# Altium project 机械臂扩展板2.0.PrjPcb
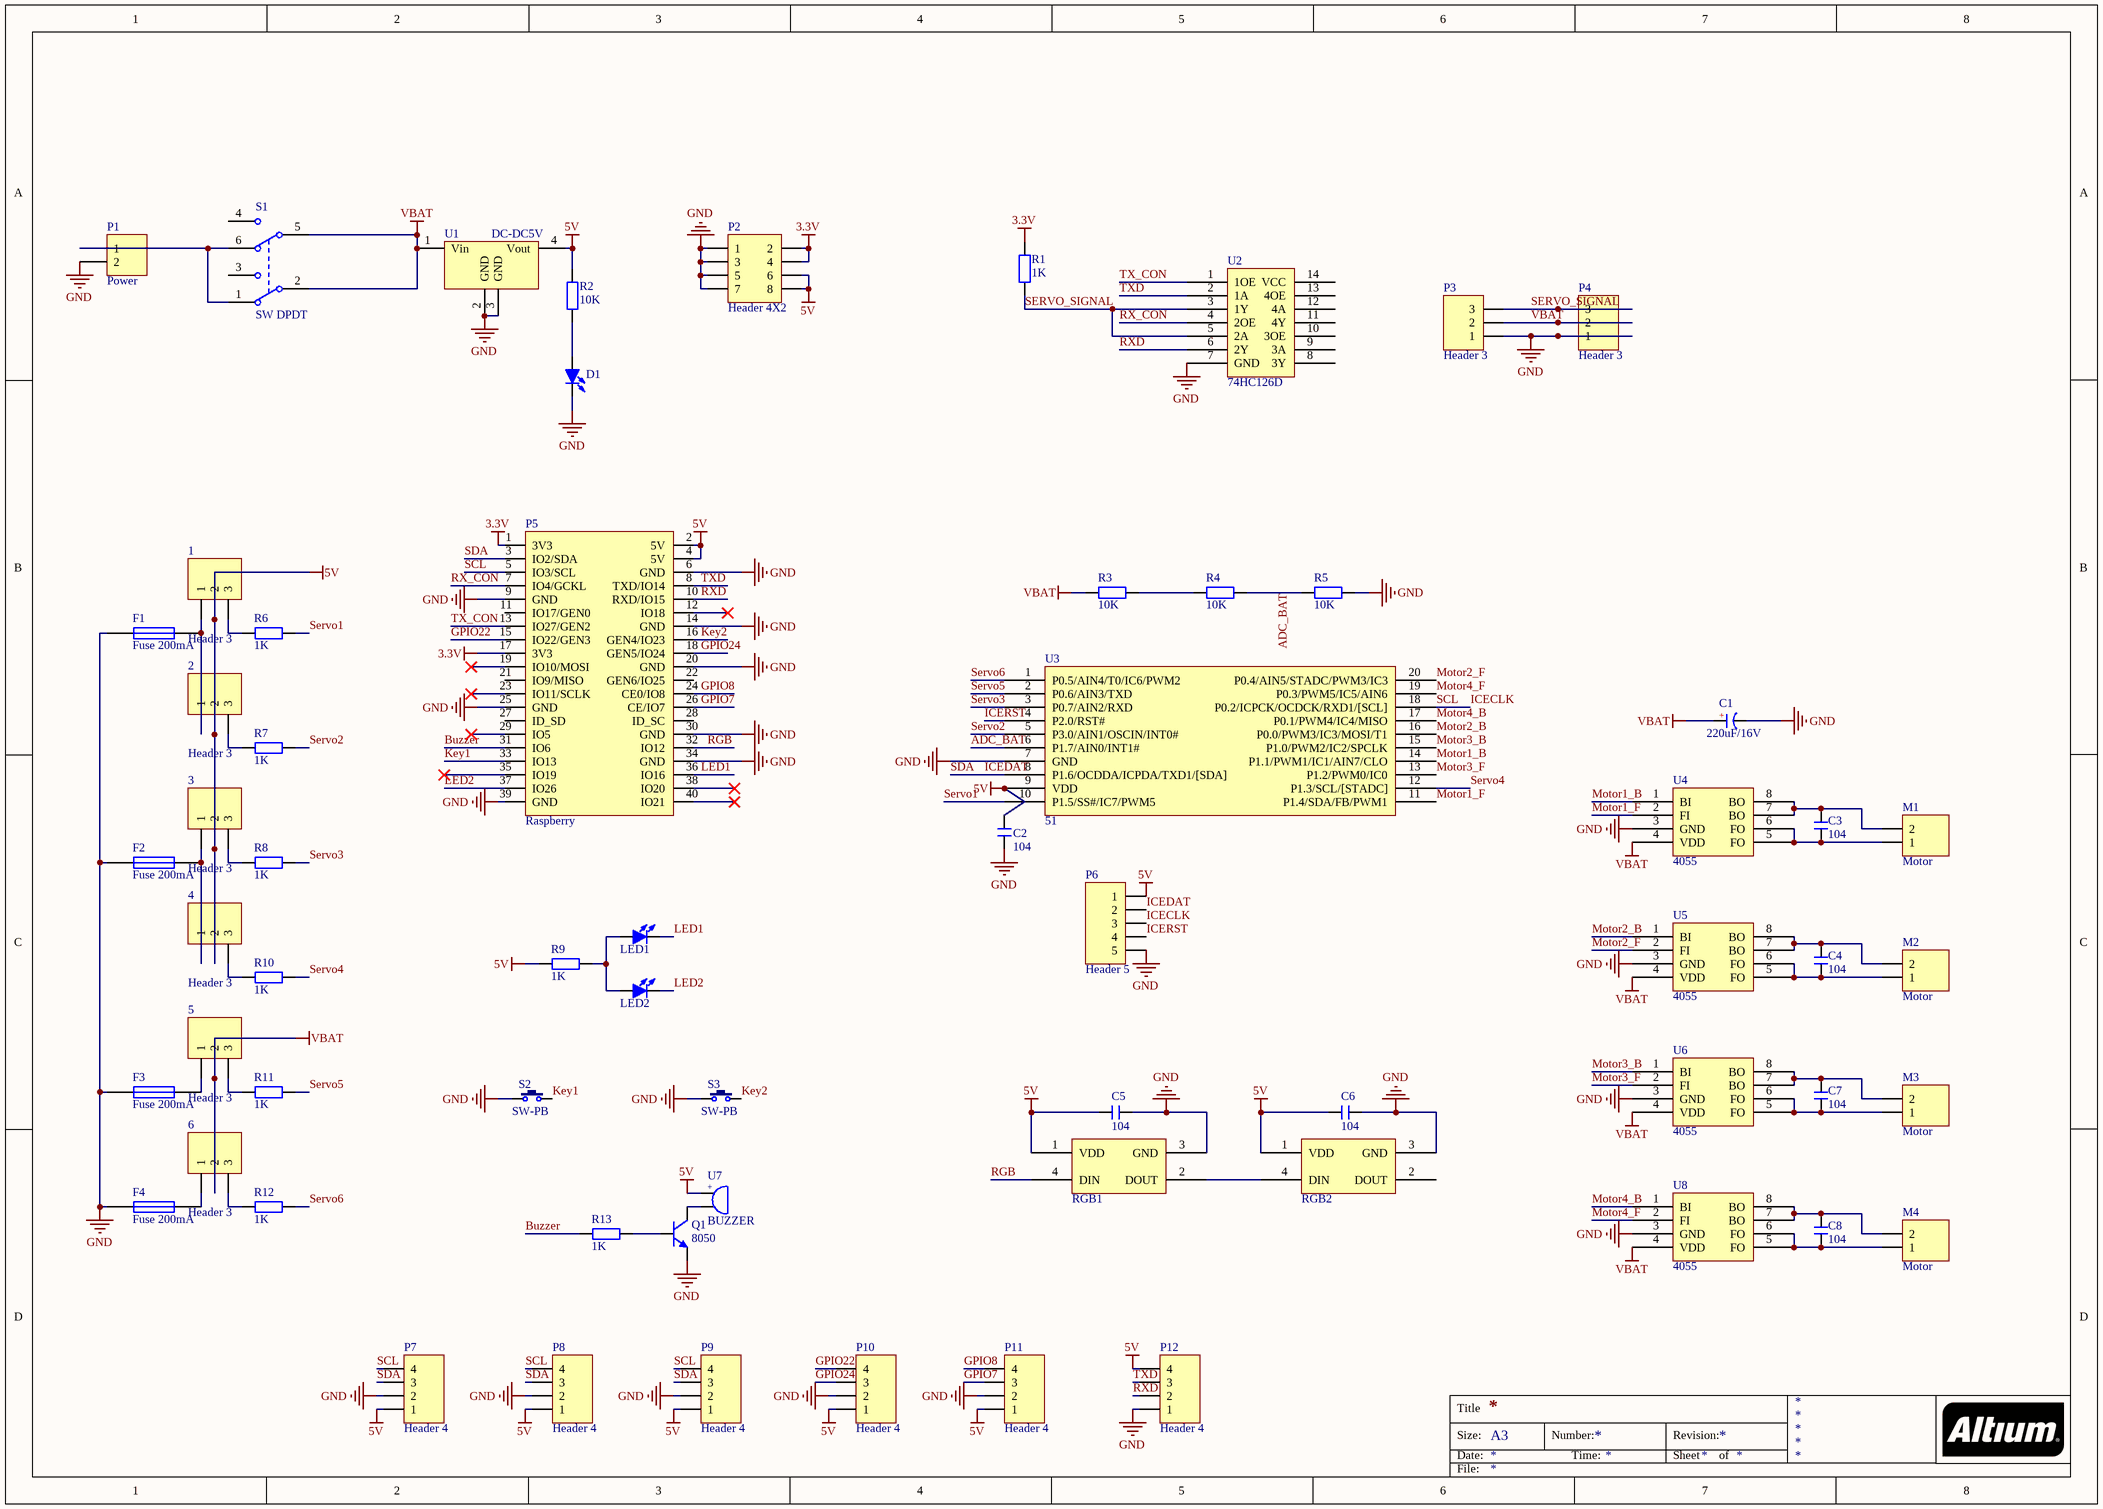
[diagram p0: 机械臂扩展板2.0.SchDoc]
1 sheet, 64 parts. Net scope: global (net labels, ports and power ports of the same name join across sheets).
Board file: 机械臂扩展板2.0.PcbDoc

## Sheet 机械臂扩展板2.0.SchDoc
size A3

### Parts
1  Header 3  [HDR2.54-LI-3P]
2  Header 3  [HDR2.54-LI-3P]
3  Header 3  [HDR2.54-LI-3P]
4  Header 3  [HDR2.54-LI-3P]
5  Header 3  [HDR2.54-LI-3P]
6  Header 3  [HDR2.54-LI-3P]
C1  220uF/16V  [CM D(6.3*7.7)]
C2  104  [C 0603_L]
C3  104  [C 0603_L]
C4  104  [C 0603_L]
C5  104  [C 0603_L]
C6  104  [C 0603_L]
C7  104  [C 0603_L]
C8  104  [C 0603_L]
D1  红色  [LED 0603R]  (value not drawn)
F1  Fuse 200mA  [F1206]
F2  Fuse 200mA  [F1206]
F3  Fuse 200mA  [F1206]
F4  Fuse 200mA  [F1206]
LED1  红色  [LED 0603G]  (value not drawn)
LED2  红色  [LED 0603G]  (value not drawn)
M1  Motor  [XH2.54-LI-2P]
M2  Motor  [XH2.54-LI-2P]
M3  Motor  [XH2.54-LI-2P]
M4  Motor  [XH2.54-LI-2P]
P1  Power  [KF128-3.81-2P]
P2  Header 4X2  [HDR2.54-LI-2x4P]
P3  Header 3  [XH2.54-LI-3P]
P4  Header 3  [XH2.54-LI-3P]
P6  Header 5  [HDR2.54-LI-5P]
P7  Header 4  [XH2.54-WI-4P]
P8  Header 4  [XH2.54-WI-4P]
P9  Header 4  [XH2.54-WI-4P]
P10  Header 4  [XH2.54-LI-4P]
P11  Header 4  [XH2.54-LI-4P]
P12  Header 4  [HDR2.54-LI-4P]
Q1  8050  [SOT23-3L]
R1  1K  [R 0603_L]
R2  10K  [R 0603_L]
R3  10K  [R 0603_L]
R4  10K  [R 0603_L]
R5  10K  [R 0603_L]
R6  1K  [R 0603_L]
R7  1K  [R 0603_L]
R8  1K  [R 0603_L]
R9  1K  [R 0603_L]
R10  1K  [R 0603_L]
R11  1K  [R 0603_L]
R12  1K  [R 0603_L]
R13  1K  [R 0603_L]
Raspberry  P5  [HDR2.54-LI-2x20P]
RGB1  (no value)  [LED 3528-4Pin]
RGB2  (no value)  [LED 3528-4Pin]
S1  SW DPDT  [SK-22D02]
S2  SW-PB  [TSW SMD-3*6*4.3]
S3  SW-PB  [TSW SMD-3*6*4.3]
U1  DC-DC5V  [升压模块]
U2  74HC126D  [SOP14_L]
U3  51  [TSSOP20_L]
U4  4055  [SOP8_L]
U5  4055  [SOP8_L]
U6  4055  [SOP8_L]
U7  BUZZER  [BEEP 5x9x5.5]
U8  4055  [SOP8_L]

### Nets
3.3V: P2.2 P2.4 R1.2 Raspberry.1(3V3) Raspberry.17(3V3)
5V: 1.2 2.2 3.2 4.2 C2.2 C5.1 C6.1 P2.6 P2.8 P6.1 P7.1 P8.1 P9.1 P10.1 P11.1 P12.4 R2.2 R9.1 Raspberry.2(5V) Raspberry.4(5V) RGB1.1(VDD) RGB2.1(VDD) U1.4(Vout) U3.9(VDD) U7.1
GND: C1.2(K) C2.1 C5.2 C6.2 D1.2(K) F1.1 F2.1 F3.1 F4.1 P1.2 P2.1 P2.3 P2.5 P2.7 P3.1 P4.1 P6.5 P7.2 P8.2 P9.2 P10.2 P11.2 P12.1 Q1.2(E) R5.2 Raspberry.6(GND) Raspberry.9(GND) Raspberry.14(GND) Raspberry.20(GND) Raspberry.25(GND) Raspberry.30(GND) Raspberry.34(GND) Raspberry.39(GND) RGB1.3(GND) RGB2.3(GND) S2.1 S3.1 U1.2(GND) U1.3(GND) U2.7(GND) U3.7(GND) U4.3(GND) U5.3(GND) U6.3(GND) U8.3(GND)
VBAT: 5.2 6.2 C1.1(A) P3.2 P4.2 R3.1 S1.2 S1.5 U1.1(Vin) U4.4(VDD) U5.4(VDD) U6.4(VDD) U8.4(VDD)
ADC_BAT: R4.2 R5.1 U3.6(P1.7/AIN0/INT1#)
Buzzer: R13.1 Raspberry.31(IO6)
GPIO7: P11.3 Raspberry.26(CE/IO7)
GPIO8: P11.4 Raspberry.24(CE0/IO8)
GPIO22: P10.4 Raspberry.15(IO22/GEN3)
GPIO24: P10.3 Raspberry.18(GEN5/IO24)
ICECLK: P6.3 P7.4 P8.4 P9.4 Raspberry.5(IO3/SCL) U3.18(P0.2/ICPCK/OCDCK/RXD1/[SCL])  [also labelled SCL]
ICEDAT: P6.2 P7.3 P8.3 P9.3 Raspberry.3(IO2/SDA) U3.8(P1.6/OCDDA/ICPDA/TXD1/[SDA])  [also labelled SDA]
ICERST: P6.4 U3.4(P2.0/RST#)
Key1: Raspberry.33(IO13) S2.2
Key2: Raspberry.16(GEN4/IO23) S3.2
LED1: LED1.2(K) Raspberry.36(IO16)
LED2: LED2.2(K) Raspberry.37(IO26)
Motor1_B: U3.14(P1.1/PWM1/IC1/AIN7/CLO) U4.1(BI)
Motor1_F: U3.11(P1.4/SDA/FB/PWM1) U4.2(FI)
Motor2_B: U3.16(P0.0/PWM3/IC3/MOSI/T1) U5.1(BI)
Motor2_F: U3.20(P0.4/AIN5/STADC/PWM3/IC3) U5.2(FI)
Motor3_B: U3.15(P1.0/PWM2/IC2/SPCLK) U6.1(BI)
Motor3_F: U3.13(P1.2/PWM0/IC0) U6.2(FI)
Motor4_B: U3.17(P0.1/PWM4/IC4/MISO) U8.1(BI)
Motor4_F: U3.19(P0.3/PWM5/IC5/AIN6) U8.2(FI)
RGB: Raspberry.32(IO12) RGB1.4(DIN)
RX_CON: Raspberry.7(IO4/GCKL) U2.4(2OE)
RXD: P12.2 Raspberry.10(RXD/IO15) U2.6(2Y)
Servo1: R6.2 U3.10(P1.5/SS#/IC7/PWM5)
Servo2: R7.2 U3.5(P3.0/AIN1/OSCIN/INT0#)
Servo3: R8.2 U3.3(P0.7/AIN2/RXD)
Servo4: R10.2 U3.12(P1.3/SCL/[STADC])
Servo5: R11.2 U3.2(P0.6/AIN3/TXD)
Servo6: R12.2 U3.1(P0.5/AIN4/T0/IC6/PWM2)
SERVO_SIGNAL: P3.3 P4.3 R1.1 U2.3(1Y) U2.5(2A)
TX_CON: Raspberry.13(IO27/GEN2) U2.1(1OE)
TXD: P12.3 Raspberry.8(TXD/IO14) U2.2(1A)
Net1_1: 1.1 2.1 F1.2
Net1_3: 1.3 R6.1
Net2_3: 2.3 R7.1
Net3_1: 3.1 4.1 F2.2
Net3_3: 3.3 R8.1
Net4_3: 4.3 R10.1
Net5_1: 5.1 F3.2
Net5_3: 5.3 R11.1
Net6_1: 6.1 F4.2
Net6_3: 6.3 R12.1
NetC3_1: C3.1 M1.1 U4.5(FO) U4.6(FO)
NetC3_2: C3.2 M1.2 U4.7(BO) U4.8(BO)
NetC4_1: C4.1 M2.1 U5.5(FO) U5.6(FO)
NetC4_2: C4.2 M2.2 U5.7(BO) U5.8(BO)
NetC7_1: C7.1 M3.1 U6.5(FO) U6.6(FO)
NetC7_2: C7.2 M3.2 U6.7(BO) U6.8(BO)
NetC8_1: C8.1 M4.1 U8.5(FO) U8.6(FO)
NetC8_2: C8.2 M4.2 U8.7(BO) U8.8(BO)
NetD1_1: D1.1(A) R2.1
NetLED1_1: LED1.1(A) LED2.1(A) R9.2
NetP1_1: P1.1 S1.1 S1.6
NetQ1_1: Q1.1(B) R13.2
NetQ1_3: Q1.3(C) U7.2
NetR3_2: R3.2 R4.1
NetRGB1_2: RGB1.2(DOUT) RGB2.4(DIN)

Not connected (* = marked no-connect by the designer): Raspberry 11(IO17/GEN0) 12(IO18)* 19(IO10/MOSI)* 21(IO9/MISO) 22(GEN6/IO25) 23(IO11/SCLK)* 27(ID_SD) 28(ID_SC) 29(IO5)* 35(IO19)* 38(IO20)* 40(IO21)*; RGB2 2(DOUT); S1 3 4; U2 8(3Y) 9(3A) 10(3OE) 11(4Y) 12(4A) 13(4OE) 14(VCC)

### Notes on the sheet
- Title
- Size:
- Date:
- A3
- Number:
- Time:
- Revision:
- Sheet
- of
- File:
- (in symbol BEEP) +
- (in symbol C-CM) +

### Library data of the parts
1-6 P3 P4 = Header 3: 舵机接口; BOM名称: 3P接插件; 版权归属: 源创客; 学习资源: www.ooocke.com
C1 = C-CM: 贴片电解电容; 版权归属: 源创客; BOM名称: 贴片电解电容; 学习资源: www.ooocke.com
C2-C8 = C: 无极性贴片电容; 版权归属: 源创客; BOM名称: 无极性贴片电容; 学习资源: www.ooocke.com
D1 LED1 LED2 = LED-SMD: 贴片LED; 版权归属: 源创客; BOM名称: 贴片LED; 学习资源: www.ooocke.com
F1-F4 = Fuse 1: Fuse; Published: 8-Jun-2000; LatestRevisionDate: 17-Jul-2002; LatestRevisionNote: Re-released for DXP Platform.; PackageReference: PIN-W2/E2.8; Publisher: Altium Limited; PackageDescription: Thru-Hole; 2 Leads
M1-M4 = Header 2: 2P接插件; 版权归属: 源创客; BOM名称: 2P接插件; 学习资源: www.ooocke.com
P2 = Header 4X2: 4*2P接插件; 版权归属: 源创客; BOM名称: 4*2P接插件; 学习资源: www.ooocke.com
P6 = Header 5: 5P接插件; 版权归属: 源创客; BOM名称: 5P接插件; 学习资源: www.ooocke.com
P7-P12 = Header 4: I2C总线接口; BOM名称: 4P接插件; 版权归属: 源创客; 学习资源: www.ooocke.com
Q1 = 8050-SMD: 高频放大-NPN型; 版权归属: 源创客; 属性: 40V 1.5A 1W 100MHZ; BOM名称: 高频放大-NPN型; 学习资源: www.ooocke.com
R1-R13 = R: 贴片电阻; 版权归属: 源创客; BOM名称: 贴片电阻; 学习资源: www.ooocke.com
Raspberry = Header 20X2: 树莓派接口; BOM名称: 20*2P接插件; 版权归属: 源创客; 学习资源: www.ooocke.com
RGB1 RGB2 = RGBLED
S1 = SSW-2P: 2路波动开关; BOM名称: 波动开关; 版权归属: 源创客; 学习资源: www.ooocke.com
S2 S3 = TSW 3x6: 3x6轻触开关; 版权归属: 源创客; BOM名称: 3x6轻触开关; 学习资源: www.ooocke.com
U7 = BEEP: 蜂鸣器; 版权归属: 源创客; BOM名称: 蜂鸣器; 学习资源: www.ooocke.com